# EAGLE design lm3410-boost-50ma (EAGLE 7.0.0)
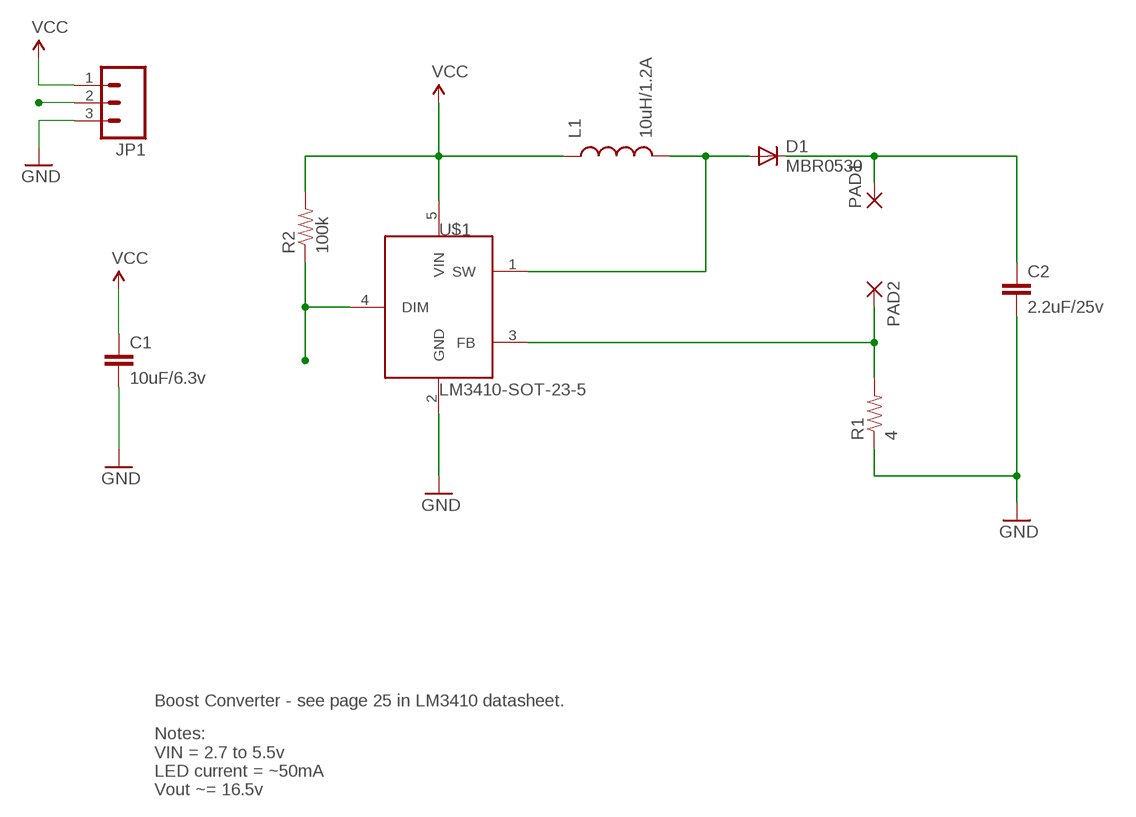
[diagram p0: schematic, sheet 1]

## Parts
C1  10uF/6.3v  CAP1206  [1206]
C2  2.2uF/25v  CAP1206  [1206]
D1  MBR0530  MBR0520LT  [SOD123]
JP1  M03PTH  [1X03]
L1  10uH/1.2A  INDUCTOR1210  [1210]
PAD1  2,54/1,0  [2,54/1,0]
PAD2  2,54/1,0  [2,54/1,0]
R1  4  RESISTOR1206  [1206]
R2  100k  RESISTOR0603-RES  [0603-RES]
U$1  LM3410-SOT-23-5  [SOT-23-5]

## Nets
DIM: JP1.2 R2.1 U$1.4(DIM)
GND: C1.2 C2.2 JP1.3 R1.1 U$1.2(GND)
N$2: D1.A L1.2 U$1.1(SW)
N$7: PAD2.1(P) R1.2 U$1.3(FB)
N$10: C2.1 D1.C PAD1.1(P)
VCC: C1.1 JP1.1 L1.1 R2.2 U$1.5(VIN)

## Notes on the sheet
- Boost Converter - see page 25 in LM3410 datasheet.
- Notes:
  VIN = 2.7 to 5.5v
  LED current = ~50mA
  Vout ~= 16.5v

## Library data of the parts
C1 = SparkFun-Capacitors:CAP: Capacitor Standard 0603 ceramic capacitor, and 0.1" leaded capacitor.
C2 = SparkFun-Passives:CAP: Capacitor Standard 0603 ceramic capacitor, and 0.1" leaded capacitor.
D1 = diode:MBR0520LT: SCHOTTKY BARRIER RECTIFIER Source: http://onsemi.com .. MBR0520LT1-D.pdf
JP1 = SparkFun-Connectors:M03: Header 3 Standard 3-pin 0.1" header. Use with straight break away headers (SKU : PRT-00116), right angle break away headers (PRT-00553), swiss pins (PRT-00743), machine pins (PRT-00117), and female headers (PRT-00115). Molex polarized connector foot print use with SKU : PRT-08232 with associated crimp pins and housings.
L1 = SparkFun-Passives:INDUCTOR: Inductors Basic Inductor/Choke - 0603 and 1206. Footprints are not proven and vary greatly between part numbers.
PAD1 PAD2 = wirepad:2,54/1,0: THROUGH-HOLE PAD
R1 R2 = SparkFun-Resistors:RESISTOR: Resistor Basic schematic elements and footprints for 0603, 1206, and PTH resistors.
U$1 = Synapseware:LM3410: LM3410/LM3410Q 525kHz/1.6MHz, Constant Current Boost and SEPIC LED Driver with Internal Compensation

## Board
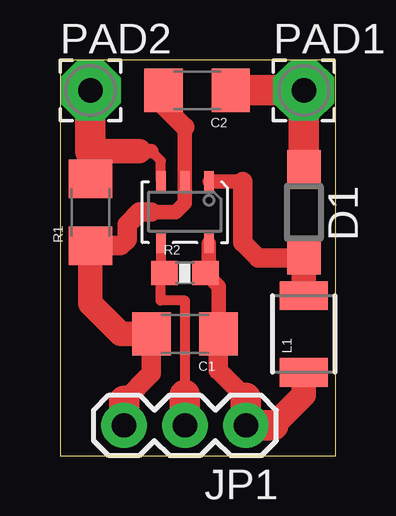
[diagram p1: board, top side]

Size 11.48 x 16.5 mm. Coordinates in mm from the lower left corner, seen from the top.
Outline: 0,0 11.48,0 11.48,16.5 0,16.5 0,0
Copper layers (1*16): Top 0.035mm / dielectric 1.5mm / Bottom 0.035mm
Design rules "default": minimum track width 10mil, minimum drill 24mil, track to track 8mil, track to pad 8mil, pad to pad 8mil, via to via 8mil, smd to smd 8mil, copper to edge 40mil, drill to drill 8mil, minimum pad ring 10mil, minimum via ring 8mil, stop-mask expansion 4mil, vias tented up to drill 0mil, thermal gap 10mil

### Footprints (pad centres in the part's own frame; a part is rotated, then mirrored left to right if it is on the bottom)
1206 = smd 1.6 x 1.8: 1 -1.4,0; 2 1.4,0
SOD123 = smd 1.4 x 1.4: A 1.9,0; C -1.9,0
1X03 = drill 1.016 pad 1.88: 1 0,0; 2 2.54,0; 3 5.08,0
1210 = smd 1.2 x 2: 1 -1.6,0; 2 1.6,0
2,54/1,0 = drill 1.016 pad 2.54 octagon: 1 0,0
0603-RES = smd 1.1 x 1: 1 -0.85,0; 2 0.85,0
SOT-23-5 = smd 0.406 x 0.813: 1 -1,-1.3; 2 0,-1.3; 3 1,-1.3; 4 1,1.3; 5 -1,1.3

### Placement (x,y rotation side)
C1  5.21,5.08 180 top
C2  5.71,15.24 180 top
D1  10.16,10.16 270 top
JP1  7.75,1.27 180 top
L1  10.16,5.08 90 top
PAD1  10.16,15.24 0 top
PAD2  1.27,15.24 0 top
R1  1.27,10.16 90 top
R2  5.21,7.62 0 top
U$1  5.21,10.16 180 top

### Tracks (layer width: path | path; a pad name or v marks a point on that pad's centre or on a via)
DIM
  Top 0.305: 4.19,7.71 R2.1
  Top 0.406: 4.19,7.71 4.19,6.48 5.21,6.48 5.21,2.54 | U$1.4 4.21,7.77
  Top 0.61: 4.21,7.77 R2.1
  Top 1.27: JP1.2 5.21,2.54
GND
  Top 0.406: 3.94,14.98 C2.2
  Top 0.61: C1.2 | 5.21,13.72 U$1.2 5.21,10.54 4.83,10.16 3.81,10.16
  Top 0.813: 2.67,2.29 3.81,3.43 C1.2 | 3.94,14.98 3.94,14.99 5.21,13.72 | 3.81,10.16 3.3,10.16 2.79,9.65 2.79,9.02 2.54,8.76 R1.1
  Top 1.016: C1.2 2.54,5.08 1.27,6.35 R1.1
  Top 1.27: JP1.3 2.67,2.29
N$2
  Top 0.406: 6.24,11.43 U$1.1
  Top 0.61: 7.62,11.43 6.24,11.43
  Top 0.813: D1.A 8.25,8.26 7.62,8.89 7.62,11.43
  Top 1.016: L1.2 D1.A
N$7
  Top 0.406: U$1.3 4.21,12.3 3.81,12.7
  Top 0.61: 3.81,12.7 3.3,12.7
  Top 1.016: R1.2 1.27,12.7 3.3,12.7
  Top 1.27: PAD2.1 1.27,12.7
N$10
  Top 1.27: D1.C PAD1.1 C2.1
VCC
  Top 0.61: U$1.5 6.21,7.77 R2.2 6.61,7.07 C1.1
  Top 0.813: 7.75,2.41 6.6,3.56 C1.1
  Top 1.016: L1.1 10.16,2.54 8.89,1.27
  Top 1.27: 7.75,2.41 JP1.1 8.89,1.27